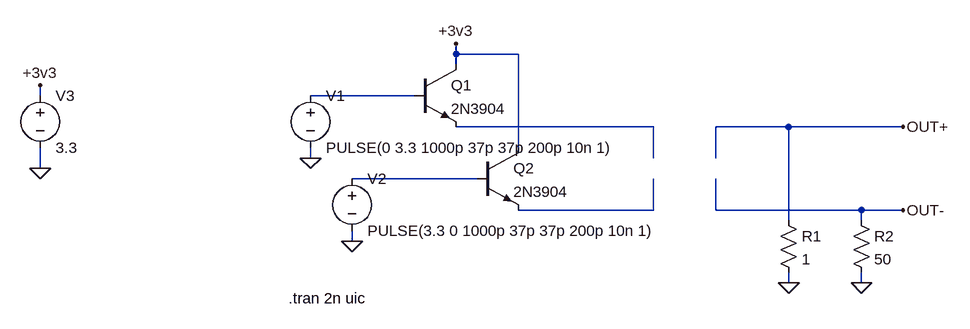
[diagram p0: schematic transmissionLineTinkering.asc]
transmissionLineTinkering.asc, the LTspice schematic file:
Version 4
SHEET 1 880 680
WIRE 80 16 80 0
WIRE 176 16 80 16
WIRE 80 32 80 16
WIRE -560 80 -560 64
WIRE 16 80 -144 80
WIRE 384 128 80 128
WIRE 592 128 480 128
WIRE 768 128 592 128
WIRE 176 160 176 16
WIRE -144 176 -144 160
WIRE 384 176 384 128
WIRE 480 176 480 128
WIRE -560 192 -560 160
WIRE 112 208 -80 208
WIRE 384 256 384 208
WIRE 384 256 176 256
WIRE 480 256 480 208
WIRE 704 256 480 256
WIRE 768 256 704 256
WIRE 592 272 592 128
WIRE 704 272 704 256
WIRE -80 304 -80 288
WIRE 592 368 592 352
WIRE 704 368 704 352
FLAG 80 0 +3v3
FLAG 592 368 0
FLAG 704 368 0
FLAG 768 128 OUT+
FLAG 768 256 OUT-
FLAG -144 176 0
FLAG -560 192 0
FLAG -80 304 0
FLAG -560 64 +3v3
SYMBOL npn 16 32 R0
SYMATTR InstName Q1
SYMATTR Value 2N3904
SYMBOL npn 112 160 R0
SYMATTR InstName Q2
SYMATTR Value 2N3904
SYMBOL res 576 256 R0
SYMATTR InstName R1
SYMATTR Value 1
SYMBOL res 688 256 R0
SYMATTR InstName R2
SYMATTR Value 50
SYMBOL voltage -144 64 R0
WINDOW 123 0 0 Left 2
WINDOW 39 0 0 Left 2
SYMATTR InstName V1
SYMATTR Value PULSE(0 3.3 1000p 37p 37p 200p 10n 1)
SYMBOL voltage -80 192 R0
WINDOW 123 0 0 Left 2
WINDOW 39 0 0 Left 2
SYMATTR InstName V2
SYMATTR Value PULSE(3.3 0 1000p 37p 37p 200p 10n 1)
SYMBOL voltage -560 64 R0
WINDOW 123 0 0 Left 2
WINDOW 39 0 0 Left 2
SYMATTR InstName V3
SYMATTR Value 3.3
TEXT -178 392 Left 2 !.tran 2n uic

The netlist it stands for:
* transmissionLineTinkering.asc
Q1 +3v3 N001 N002 0 2N3904
Q2 +3v3 N003 N004 0 2N3904
R1 OUT+ 0 1
R2 OUT- 0 50
V1 N001 0 PULSE(0 3.3 1000p 37p 37p 200p 10n 1)
V2 N003 0 PULSE(3.3 0 1000p 37p 37p 200p 10n 1)
V3 +3v3 0 3.3
.model NPN NPN
.model PNP PNP
.lib standard.bjt
.tran 2n uic
.backanno
.end